# Altium schematic sheet HLK-M20_8266-SUIT-V2.1.SchDoc
size A4
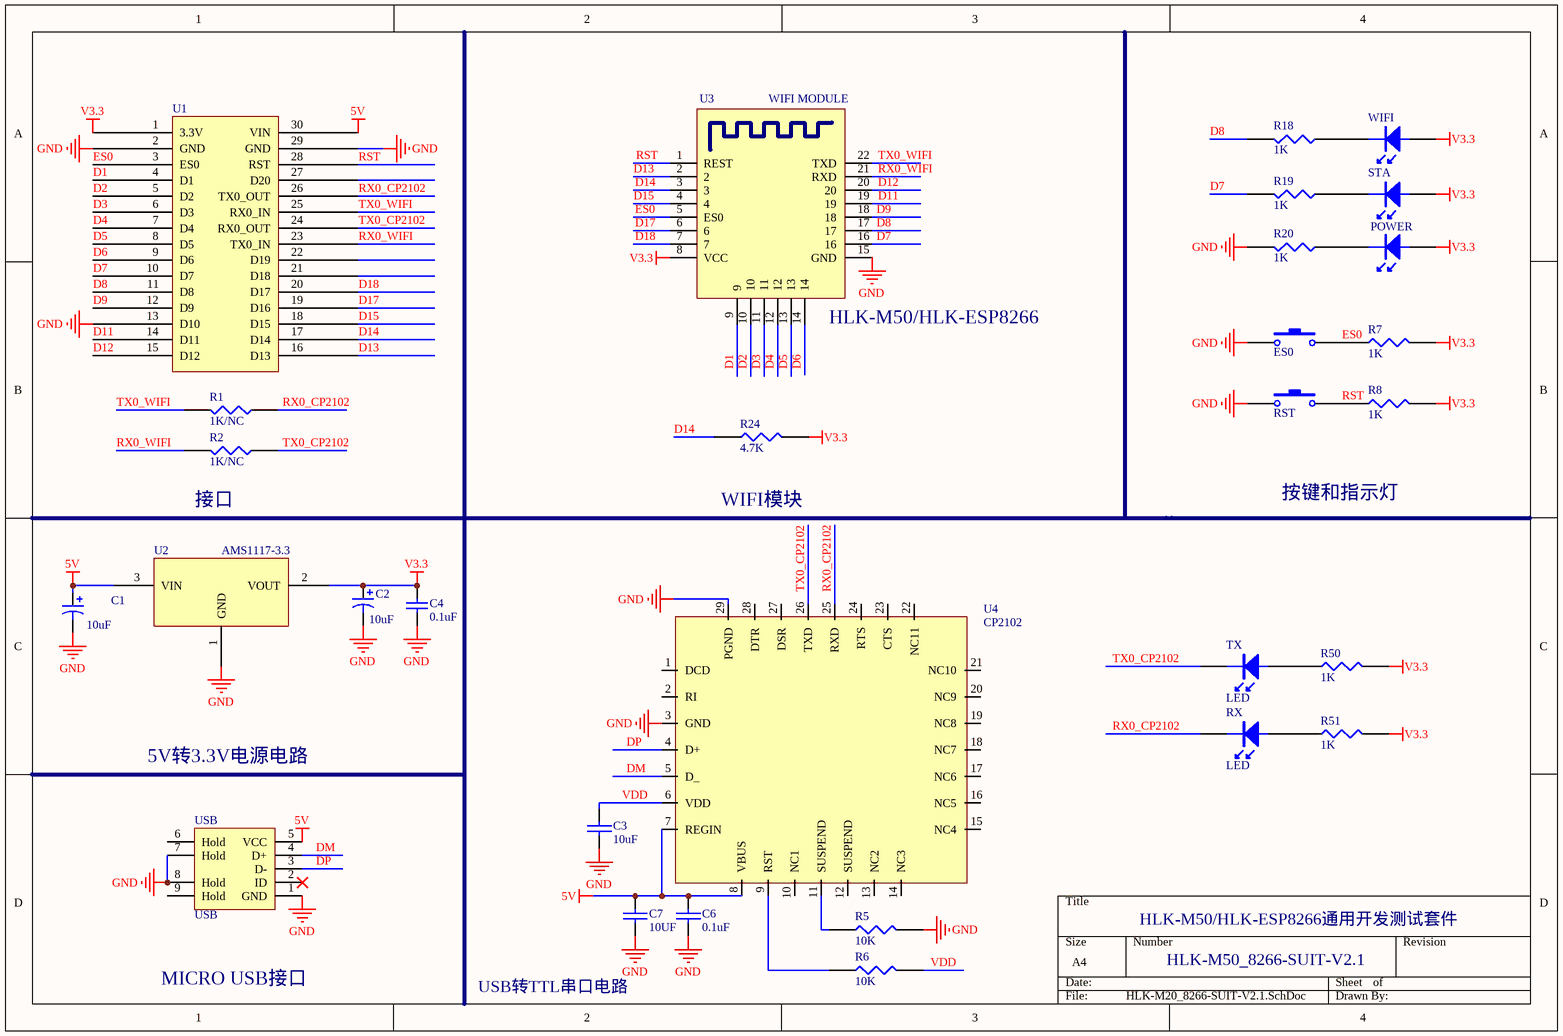
[diagram p0: HLK-M20_8266-SUIT-V2.1.SchDoc]

## Parts
C1  10uF  [0805S]
C2  10uF  [0805S]
C3  10uF  [0603L]
C4  0.1uF  [0603L]
C6  0.1uF  [0603L]
C7  10UF  [0603L]
ES0  SW-PB  [小按键]  (value not drawn)
POWER  LED  [0603LED]  (value not drawn)
R1  1K/NC  [0603L]
R2  1K/NC  [0603L]
R5  10K  [0603L]
R6  10K  [0603L]
R7  1K  [0603L]
R8  1K  [0603L]
R18  1K  [0603L]
R19  1K  [0603L]
R20  1K  [0603L]
R24  4.7K  [0603L]
R50  1K  [0603L]
R51  1K  [0603L]
RST  SW-PB  [小按键]  (value not drawn)
RX  LED  [0603LED]
STA  LED3  [0603LED]  (value not drawn)
TX  LED  [0603LED]
U1  (no value)  [转接板]
U2  AMS1117-3.3  [AMS1117]
U3  WIFI MODULE  [MOD1]
U4  CP2102  [cp2102]
USB  USB  [usb]
WIFI  LED2  [0603LED]  (value not drawn)

## Nets
5V: C1.1 C6.2 C7.2 U1.30(VIN) U2.3(VIN) U4.7(REGIN) U4.8(VBUS) USB.5(VCC)
GND: C1.2 C2.2 C3.1 C4.1 C6.1 C7.1 ES0.2 R5.2 R20.2 RST.2 U1.2(GND) U1.13(D10) U1.29(GND) U2.1(GND) U3.15(GND) U4.3(GND) U4.29(PGND) USB.1(GND) USB.7(Hold) USB.8(Hold)
V3.3: C2.1 C4.2 POWER.1 R7.2 R8.2 R24.2 R50.2 R51.2 STA.1 U1.1(3.3V) U2.2(VOUT) U3.8(VCC) WIFI.1
D1: U1.4(D1) U3.9
D2: U1.5(D2) U3.10
D3: U1.6(D3) U3.11
D4: U1.7(D4) U3.12
D5: U1.8(D5) U3.13
D6: U1.9(D6) U3.14
D7: R19.2 U1.10(D7) U3.16
D8: R18.2 U1.11(D8) U3.17
D9: U1.12(D9) U3.18
D11: U1.14(D11) U3.19
D12: U1.15(D12) U3.20
D13: U1.16(D13) U3.2
D14: R24.1 U1.17(D14) U3.3
D15: U1.18(D15) U3.4
D17: U1.19(D16) U3.6
D18: U1.20(D17) U3.7
DM: U4.5(D_) USB.4(D+)
DP: U4.4(D+) USB.3(D-)
ES0: ES0.1 R7.1 U1.3(ES0) U3.5(ES0)
RST: R8.1 RST.1 U1.28(RST) U3.1(REST)
RX0_CP2102: R1.1 RX.2 U1.26(TX0_OUT) U4.25(RXD)
RX0_WIFI: R2.2 U1.23(TX0_IN) U3.21(RXD)
TX0_CP2102: R2.1 TX.2 U1.24(RX0_OUT) U4.26(TXD)
TX0_WIFI: R1.2 U1.25(RX0_IN) U3.22(TXD)
VDD: C3.2 R6.2 U4.6(VDD)
NetPOWER_2: POWER.2 R20.1
NetR5_1: R5.1 U4.11(SUSPEND)
NetR6_1: R6.1 U4.9(RST)
NetR18_1: R18.1 WIFI.2
NetR19_1: R19.1 STA.2
NetR50_1: R50.1 TX.1
NetR51_1: R51.1 RX.1

Not connected (* = marked no-connect by the designer): U1 21(D18) 22(D19) 27(D20); U4 1(DCD) 2(RI) 10(NC1) 12(SUSPEND) 13(NC2) 14(NC3) 15(NC4) 16(NC5) 17(NC6) 18(NC7) 19(NC8) 20(NC9) 21(NC10) 22(NC11) 23(CTS) 24(RTS) 27(DSR) 28(DTR); USB 2(ID)* 6(Hold) 9(Hold)

## Notes on the sheet
- (near U3) HLK-M50/HLK-ESP8266
- (near R2) 接口
- (near R24) WIFI模块
- 按键和指示灯
- 5V转3.3V电源电路
- HLK-M50/HLK-ESP8266通用开发测试套件
- MICRO USB接口
- HLK-M50_8266-SUIT-V2.1
- USB转TTL串口电路

## Library data of the parts
C1 C2 = Cap Pol2: Polarized Capacitor (Axial); Published: *; LatestRevisionDate: *; LatestRevisionNote: *; PackageReference: *; Publisher: *; Value: *
C3 C6 C7 = CAP: Capacitor
C4 = Cap: Capacitor; Published: *; LatestRevisionDate: *; LatestRevisionNote: *; PackageReference: *; Publisher: *; Value: *
ES0 RST = SW-PB: Switch; Published: 24-Mar-1999; LatestRevisionDate: 17-Jul-2002; LatestRevisionNote: Re-released for DXP Platform.; PackageReference: SPST-2; Publisher: Altium Limited
R1 R2 R5-R8 R18-R20 R24 R50 R51 = RES1
STA WIFI = LED
U1 = 转接板
U3 = MOD1
U4 = Component_1
USB = USB-B